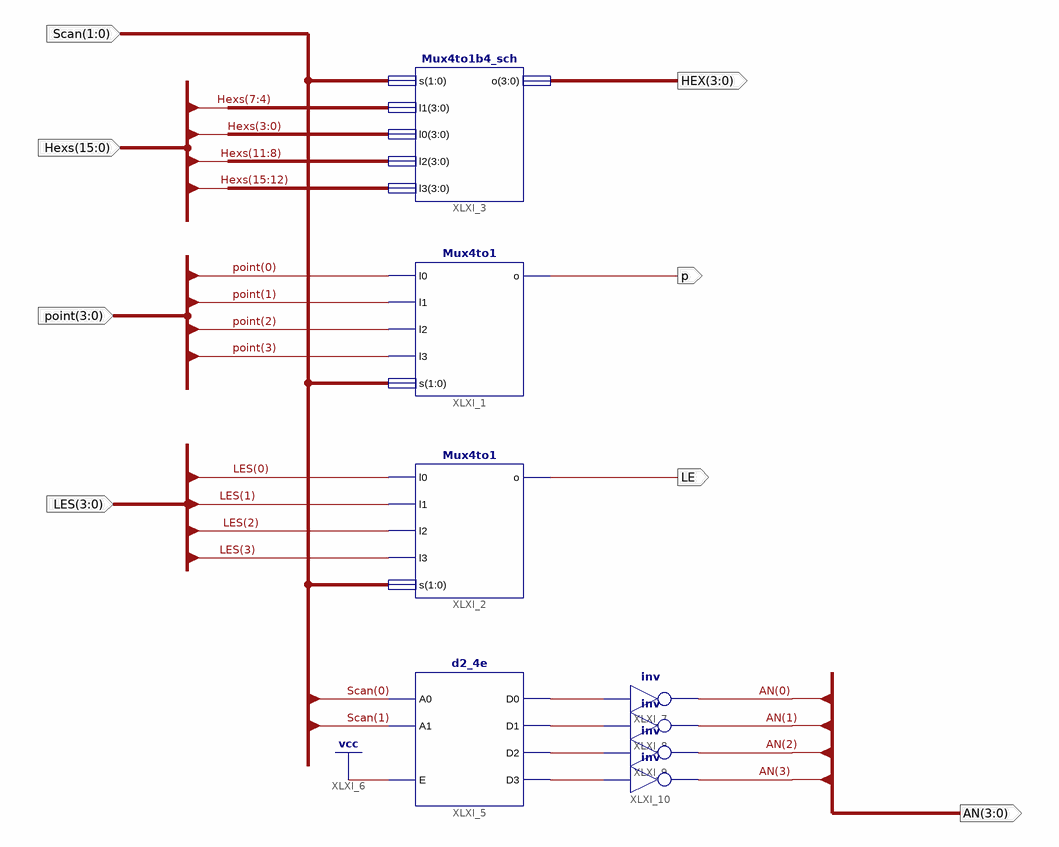
[diagram p0: schematic sheet 1]
// Xilinx ISE schematic DisplatSync_sch.sch (kintex7) as structural Verilog: 8 symbols, 8 ports
module DisplatSync_sch (
  input  [1:0] Scan,
  input  [15:0] Hexs,
  input  [3:0] point,
  input  [3:0] LES,
  output [3:0] HEX,
  output p,
  output LE,
  output [3:0] AN
);

  wire XLXN_43, XLXN_44, XLXN_45, XLXN_46;

  Mux4to1 XLXI_1 (.l0(point[0]), .l1(point[1]), .l2(point[2]), .l3(point[3]), .s(Scan), .o(p));
  Mux4to1 XLXI_2 (.l0(LES[0]), .l1(LES[1]), .l2(LES[2]), .l3(LES[3]), .s(Scan), .o(LE));
  Mux4to1b4_sch XLXI_3 (.s(Scan), .l1(Hexs[7:4]), .l0(Hexs[3:0]), .l2(Hexs[11:8]), .l3(Hexs[15:12]), .o(HEX));
  d2_4e XLXI_5 (.A0(Scan[0]), .A1(Scan[1]), .E(1'b1), .D0(XLXN_43), .D1(XLXN_44), .D2(XLXN_45), .D3(XLXN_46));
  not XLXI_7 (AN[0], XLXN_43);
  not XLXI_8 (AN[1], XLXN_44);
  not XLXI_9 (AN[2], XLXN_45);
  not XLXI_10 (AN[3], XLXN_46);
endmodule
